# EAGLE design node_captor_piezo (EAGLE 7.2.0)
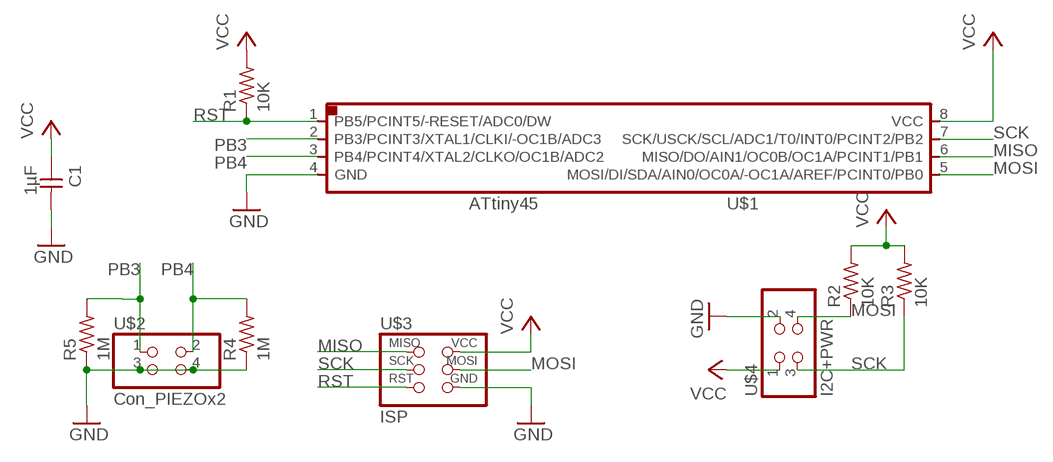
[diagram p0: schematic, sheet 1]

## Parts
C1  1µF  CAP-UNPOLARIZEDFAB  [C1206FAB]
R1  10K  RES-US1206FAB  [R1206FAB]
R2  10K  RES-US1206FAB  [R1206FAB]
R3  10K  RES-US1206FAB  [R1206FAB]
R4  1M  RES-US1206FAB  [R1206FAB]
R5  1M  RES-US1206FAB  [R1206FAB]
U$1  ATTINY45SI  [SOIC8]
U$2  Con_PIEZOx2  PINHD-2X2-SMD  [2X02SMD]
U$3  ISP  AVRISPSMD  [2X03SMD]
U$4  I2C+PWR  PINHD-2X2-SMD  [2X02SMD]

## Nets
GND: C1.2 R4.1 R5.1 U$1.4(GND) U$2.3 U$2.4 U$3.6(GND) U$4.2
MISO: U$1.6(MISO/DO/AIN1/OC0B/OC1A/PCINT1/PB1) U$3.1(MISO)
MOSI: R2.1 U$1.5(MOSI/DI/SDA/AIN0/OC0A/-OC1A/AREF/PCINT0/PB0) U$3.4(MOSI) U$4.4
PB3: R5.2 U$1.2(PB3/PCINT3/XTAL1/CLKI/-OC1B/ADC3) U$2.1
PB4: R4.2 U$1.3(PB4/PCINT4/XTAL2/CLKO/OC1B/ADC2) U$2.2
RST: R1.1 U$1.1(PB5/PCINT5/-RESET/ADC0/DW) U$3.5(RST)
SCK: R3.1 U$1.7(SCK/USCK/SCL/ADC1/T0/INT0/PCINT2/PB2) U$3.3(SCK) U$4.3
VCC: C1.1 R1.2 R2.2 R3.2 U$1.8(VCC) U$3.2(VCC) U$4.1

## Library data of the parts
C1 = fab:CAP-UNPOLARIZED
R1-R5 = fab:RES-US: Resistor (US Symbol) Variants with postfix FAB are widened to allow the routing of internal traces
U$1 = fab2:ATTINY45
U$2 U$4 = fab:PINHD-2X2-SMD
U$3 = fab:AVRISP

## Board
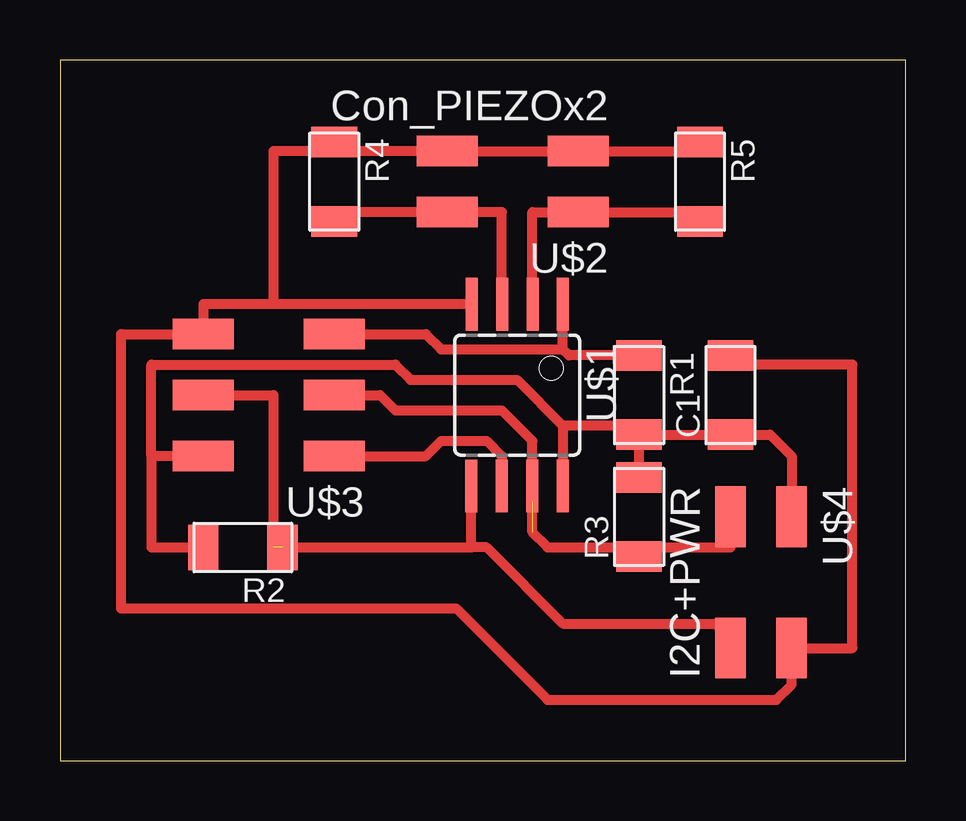
[diagram p1: board, top side]

Size 35.23 x 29.2 mm. Coordinates in mm from the lower left corner, seen from the top.
Outline: 0,0 35.23,0 35.23,29.2 0,29.2 0,0
Copper layers (1*16): Top 0.035mm / dielectric 1.5mm / Bottom 0.035mm
Design rules "default": minimum track width 10mil, minimum drill 24mil, track to track 8mil, track to pad 8mil, pad to pad 8mil, via to via 8mil, smd to smd 8mil, copper to edge 40mil, drill to drill 8mil, minimum pad ring 10mil, minimum via ring 8mil, stop-mask expansion 4mil, vias tented up to drill 0mil, thermal gap 10mil

### Footprints (pad centres in the part's own frame; a part is rotated, then mirrored left to right if it is on the bottom)
C1206FAB = smd 1.27 x 1.905: 1 -1.651,0; 2 1.651,0
R1206FAB = smd 1.27 x 1.905: 1 -1.651,0; 2 1.651,0
SOIC8 = smd 0.5 x 2.2: 1 -1.905,-3.789; 2 -0.645,-3.789; 3 0.625,-3.789; 4 1.895,-3.789; 5 1.905,3.789; 6 0.635,3.789; 7 -0.635,3.789; 8 -1.905,3.789
2X02SMD = smd 2.54 x 1.27: 1 -2.54,1.27; 2 2.92,1.27; 3 -2.54,-1.27; 4 2.92,-1.27
2X03SMD = smd 2.54 x 1.27: 1 -2.54,2.54; 2 2.92,2.54; 3 -2.54,0; 4 2.92,0; 5 -2.54,-2.54; 6 2.92,-2.54

### Placement (x,y rotation side)
C1  27.94,15.24 90 top
R1  24.13,15.24 270 top
R2  7.62,8.89 180 top
R3  24.13,10.16 90 top
R4  11.43,24.13 270 top
R5  26.67,24.13 270 top
U$1  19.05,15.24 180 top
U$2  19.05,24.13 180 top
U$3  8.89,15.24 180 top
U$4  29.21,7.62 270 top

### Tracks (layer width: path | path; a pad name or v marks a point on that pad's centre or on a via)
GND
  Top 0.406: C1.2 27.94,16.51 33.02,16.51 33.02,4.7 U$4.2 30.48,3.18 29.84,2.54 20.32,2.54 16.51,6.35 2.54,6.35 2.54,17.78 U$3.6 5.97,19.03 8.89,19.03 | U$1.4 8.89,19.03 | 11.43,25.4 U$2.4 U$2.3 26.67,25.4 R5.1 | 11.43,25.4 8.89,25.4 8.89,19.03 | R4.1 11.43,25.4
MISO
  Top 0.406: U$3.1 15.24,12.7 15.88,13.34 17.78,13.34 18.41,12.7 U$1.6
MOSI  (1 unrouted)
  Top 0.406: U$3.4 8.89,15.24 8.89,8.89 17.14,8.89 | 17.14,8.89 17.78,8.89 20.95,5.71 27.3,5.71 27.94,5.08 U$4.4 | 17.14,8.89 U$1.5
PB3
  Top 0.406: U$1.2 19.69,19.03 19.69,22.86 U$2.1 26.67,22.86 R5.2
PB4
  Top 0.406: U$1.3 18.41,22.86 U$2.2 11.43,22.86 R4.2
RST
  Top 0.406: U$3.5 15.24,17.78 15.88,17.14 20.95,17.14 | 20.95,17.14 U$1.1 | R1.1 21.21,16.89 20.95,17.14
SCK  (1 unrouted)
  Top 0.406: U$3.3 13.33,15.24 13.97,14.61 18.41,14.61 19.69,13.34 19.69,9.53 20.32,8.89 24.13,8.89 | 19.69,10.79 U$1.7 | 24.13,8.89 R3.1 | 24.13,8.89 27.94,8.89 U$4.3
VCC
  Top 0.406: U$3.2 3.81,12.7 | 3.81,12.7 3.81,16.51 13.97,16.51 14.6,15.88 19.05,15.88 20.95,13.97 | 20.95,13.97 U$1.8 | R1.2 24.13,13.97 20.95,13.97 | R1.2 C1.1 29.59,13.59 30.48,12.7 U$4.1 | R3.2 R1.2 | 3.81,12.7 3.81,8.89 R2.2